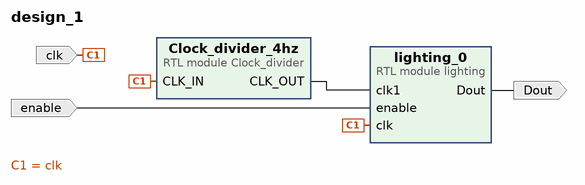
[diagram p0: block diagram of the top level]
# Vivado block design design_1, xc7z020clg400-1, Vivado 2022.1
create_bd_design design_1

create_bd_port -dir I enable
create_bd_port -dir O Dout
create_bd_port -dir I -type clk clk
set_property -dict {CONFIG.FREQ_HZ 125000000} [get_bd_ports clk]

create_bd_cell -type module -reference Clock_divider Clock_divider_4hz
set_property -dict {CONFIG.DIVISOR 0x1DCD650} [get_bd_cells Clock_divider_4hz]
create_bd_cell -type module -reference lighting lighting_0

# ---- connections ----

connect_bd_net -net Clock_divider_0_CLK_OUT [get_bd_pins Clock_divider_4hz/CLK_OUT] [get_bd_pins lighting_0/clk1]
connect_bd_net [get_bd_ports clk] [get_bd_pins Clock_divider_4hz/CLK_IN] [get_bd_pins lighting_0/clk]
connect_bd_net [get_bd_ports enable] [get_bd_pins lighting_0/enable]
connect_bd_net [get_bd_pins lighting_0/Dout] [get_bd_ports Dout]

validate_bd_design
save_bd_design
